# EAGLE design SW3 (EAGLE 5.06)
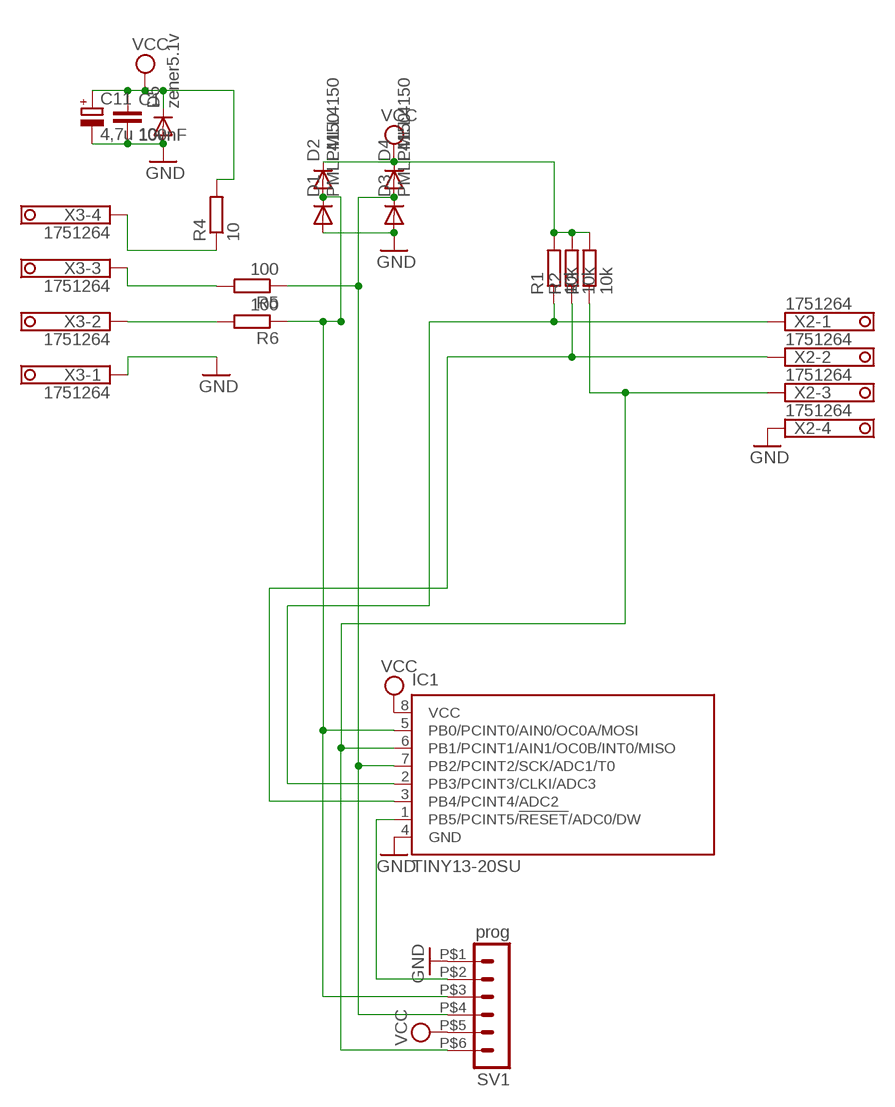
[diagram p0: schematic, sheet 1]

## Parts
C1  100nF  C-EUC0805  [C0805]
C11  4,7u 10v  CPOL-EUB/3528-21R  [B/3528-21R]
D1  PMLL4150  [SOD80C]
D2  PMLL4150  [SOD80C]
D3  PMLL4150  [SOD80C]
D4  PMLL4150  [SOD80C]
D5  zener5.1v  PMLL4150  [SOD80C]
IC1  TINY13-20SU  [8S2]
R1  10k  R-EU_R0805  [R0805]
R2  10k  R-EU_R0805  [R0805]
R3  10k  R-EU_R0805  [R0805]
R4  10  R-EU_R0805  [R0805]
R5  100  R-EU_R1206  [R1206]
R6  100  R-EU_R1206  [R1206]
SV1  prog  MA06-1'  [MA06-1_SMD_MINI]
X2  1751264  [1751264]
X3  1751264  [1751264]

## Nets
GND: C1.2 C11.- D1.A D3.A D5.A IC1.4(GND) SV1.P$1 X2.4 X3.1
MISO: IC1.6(PB1/PCINT1/AIN1/OC0B/INT0/MISO) R3.1 SV1.P$6 X2.3
MOSI: D1.C D2.A IC1.5(PB0/PCINT0/AIN0/OC0A/MOSI) R6.1 SV1.P$3
N$1: IC1.1(PB5/PCINT5/!RESET!/ADC0/DW) SV1.P$2
N$15: IC1.3(PB4/PCINT4/ADC2) R2.1 X2.2
N$16: R6.2 X3.2
N$17: R5.2 X3.3
N$18: R4.1 X3.4
N$19: IC1.2(PB3/PCINT3/CLKI/ADC3) R1.1 X2.1
SCK: D3.C D4.A IC1.7(PB2/PCINT2/SCK/ADC1/T0) R5.1 SV1.P$4
VCC: C1.1 C11.+ D2.C D4.C D5.C IC1.8(VCC) R1.2 R2.2 R3.2 R4.2 SV1.P$5

## Library data of the parts
C1 = rcl:C-EU: CAPACITOR, European symbol
C11 = rcl:CPOL-EU: POLARIZED CAPACITOR, European symbol
D1-D5 = diode:PMLL4150: DIODE high speed
IC1 = atmel:TINY13: 8-bit AVR Microcontroller with 1K Bytes In-System Programmable Flash Source: http://www.atmel.com/dyn/resources/prod_documents/2535S.pdf
R1-R6 = rcl:R-EU_: RESISTOR, European symbol
SV1 = con-lstb:MA06-1: PIN HEADER
X2 X3 = con-phoenix-350:1751264: MKDS 1/ 4-3,5 Printklemme Nennstrom: 10 A Bemessungsspannung: 160 V Raster: 3,5 mm Polzahl: 4 Montageart: Löten Anschlussart: Schraubanschluss Anschlussrichtung vom Leiter zur Platine: 0° Source: http://eshop.phoenixcontact.com .. 1751264.pdf

## Board
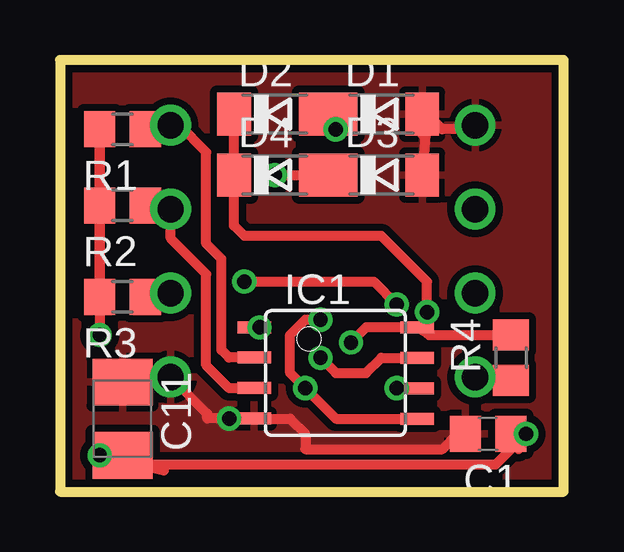
[diagram p1: board, top side]
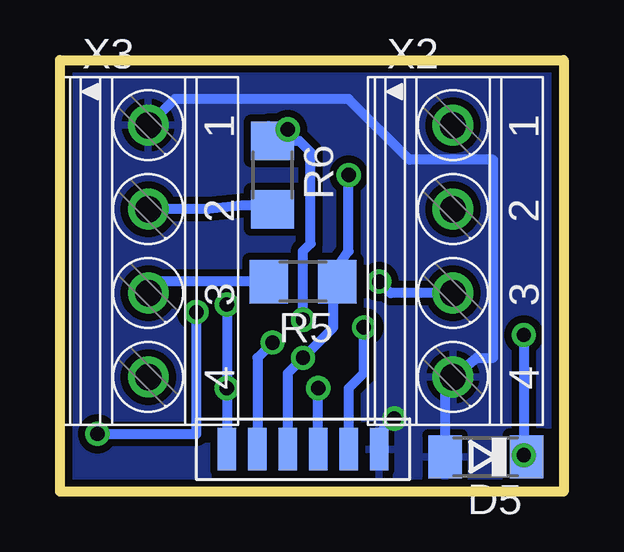
[diagram p2: board, bottom side, seen from below]

Size 21 x 18 mm. Coordinates in mm from the lower left corner, seen from the top.
Outline: 0,0 21,0 21,18 0,18 0,0
Copper layers (1*16): Top 0.035mm / dielectric 1.5mm / Bottom 0.035mm
Design rules "default *": minimum track width 10mil, minimum drill 16mil, track to track 8mil, track to pad 8mil, pad to pad 8mil, via to via 8mil, smd to smd 0mil, copper to edge 10mil, drill to drill 8mil, minimum pad ring 10mil, minimum via ring 8mil, stop-mask expansion 4mil, vias tented up to drill 0mil, thermal gap 10mil

### Footprints (pad centres in the part's own frame; a part is rotated, then mirrored left to right if it is on the bottom)
C0805 = smd 1.3 x 1.5: 1 -0.95,0; 2 0.95,0
B/3528-21R = smd 1.95 x 2.5: + 1.525,0; - -1.525,0
SOD80C = smd 1.4 x 1.8: A 1.7,0; C -1.7,0
8S2 = smd 0.5 x 1.4: 1 -1.905,-3.404; 2 -0.645,-3.404; 3 0.625,-3.404; 4 1.895,-3.404; 5 1.905,3.404; 6 0.635,3.404; 7 -0.635,3.404; 8 -1.905,3.404
R0805 = smd 1.3 x 1.5: 1 -0.95,0; 2 0.95,0
R1206 = smd 1.6 x 1.803: 1 -1.422,0; 2 1.422,0
MA06-1_SMD_MINI = smd 0.762 x 1.778: P$1 -3.81,0; P$2 -2.54,0; P$3 -1.27,0; P$4 0,0; P$5 1.27,0; P$6 2.54,0
1751264 = drill 1.1 pad 1.7 round: 1 -5.25,-0.1; 2 -1.75,-0.1; 3 1.75,-0.1; 4 5.25,-0.1

### Placement (x,y rotation side)
C1  17.85,2.41 180 top
C11  2.61,3.04 270 top
D1  13.41,15.74 0 top
D2  8.96,15.74 0 top
D3  13.41,13.2 0 top
D4  8.96,13.2 0 top
D5  3.25,1.45 180 bottom
IC1  11.5,4.94 270 top
R1  2.61,15.11 180 top
R2  2.61,11.93 180 top
R3  2.61,8.12 180 top
R4  18.8,5.58 90 top
R5  10.86,8.75 180 bottom
R6  12.13,13.2 270 bottom
SV1  11.5,1.77 180 bottom
X2  4.52,10.03 270 bottom
X3  17.22,10.03 270 bottom

### Tracks (layer width: path | path; a pad name or v marks a point on that pad's centre or on a via)
GND  (via drill 0.6)
  Top 0.406: D3.A 15.31,15.74 15.63,15.42 | 15.63,15.42 15.95,15.11 17.15,15.11 X3.1 | D1.A 15.1,14.9 15.63,15.42 | C1.2 16.58,2.41 15.95,1.77 10.23,1.77 10.23,2.41 9.59,3.04 v7.06,3.04 IC1.4 6.14,3.05 6.14,3.25 X2.4 4.41,4.56 C11.-
  Bottom 0.406: 4.86,4.33 4.94,4.25 | X2.4 3.63,5.58 2.93,5.58 2.93,13.83 6.42,13.83 8.96,16.38 16.22,16.38 X3.1 | X2.4 4.52,4.67 | SV1.P$1 7.69,2.41 v7.06,3.04 | 4.86,4.33 4.94,4.33 D5.A | 4.86,4.33 4.86,4.53 X2.4
  pour Top (isolate 0.305): 20.71,17.33 0.39,17.33 0.39,-0.13 20.71,-0.13
  pour Bottom (isolate 0.305): 20.71,17.33 0.39,17.33 0.39,-0.13 20.71,-0.13
MISO  (via drill 0.6)
  Top 0.406: v14.04,4.31 IC1.6 | R3.1 4.26,8.12 X2.3 | v14.04,7.8 13.09,8.75 v7.69,8.75
  Bottom 0.406: SV1.P$6 v14.04,4.31 v14.04,7.8 | X2.3 7.21,8.28 v7.69,8.75
MOSI  (via drill 0.6)
  Top 0.406: IC1.5 11.5,3.04 v10.23,4.31 9.59,4.94 9.59,6.53 10.23,7.17 v10.86,7.17 | v11.5,15.11 D2.A | v11.5,15.11 D1.C v11.5,15.11
  Bottom 0.406: SV1.P$3 v10.23,4.31 | v11.5,15.11 12.29,15.26 R6.1 11.02,14.62 10.55,14.15 10.55,10.34 10.86,10.03 10.86,7.48 10.55,7.17 v10.86,7.17
N$1  (via drill 0.6)
  Top 0.406: v8.33,6.85 IC1.1
  Bottom 0.406: v8.33,6.85 8.33,4.94 8.96,4.31 SV1.P$2
N$15
  Top 0.406: R2.1 4.26,11.93 X2.2 4.61,10.56 6.1,9.07 6.1,5.26 7.06,4.31 8.09,4.31 IC1.3
N$16
  Bottom 0.406: X3.2 14.83,11.78 13.41,11.93 12.29,11.93 R6.2
N$17
  Bottom 0.406: R5.2 16.84,8.75 X3.3
N$18
  Top 0.61: R4.1 17.22,4.67 X3.4
N$19
  Top 0.406: R1.1 4.25,15.11 X2.1 4.98,15.28 6.1,14.15 6.1,10.34 6.74,9.71 6.74,5.9 7.05,5.59 IC1.2
SCK  (via drill 0.6)
  Top 0.406: D4.A D3.C v8.96,13.2 | v10.86,5.58 11.5,4.94 12.77,4.94 13.41,5.58 IC1.7
  Bottom 0.406: 9.59,9.24 9.59,6.85 v10.86,5.58 11.5,4.94 SV1.P$4 | 9.59,9.24 R5.1 9.76,8.91 8.96,10.03 v8.96,13.2 | 9.59,9.24 9.44,9.39
VCC  (via drill 0.6)
  Top 0.406: R3.2 R2.2 R1.2 v1.66,6.53 | D2.C D4.C 7.26,11.09 7.69,10.66 13.41,10.66 15.31,8.75 v15.31,7.48 15.31,6.62 | 15.31,6.62 IC1.8 12.77,6.85 v12.13,6.22 | R4.2 15.4,6.53 15.31,6.62 | v1.66,1.52 2.23,1.52 2.61,1.14 18.17,1.14 v19.44,2.41 C1.1 19.12,2.08 19.12,1.77 | v1.66,1.52 C11.+ | v1.66,1.52 4.34,0.88
  Bottom 0.305: D5.C 1.55,1.4 v1.66,1.52
  Bottom 0.406: v15.31,7.48 15.31,2.41 v19.44,2.41 | SV1.P$5 12.77,5.58 v12.13,6.22 | v1.66,6.53 v1.66,1.52